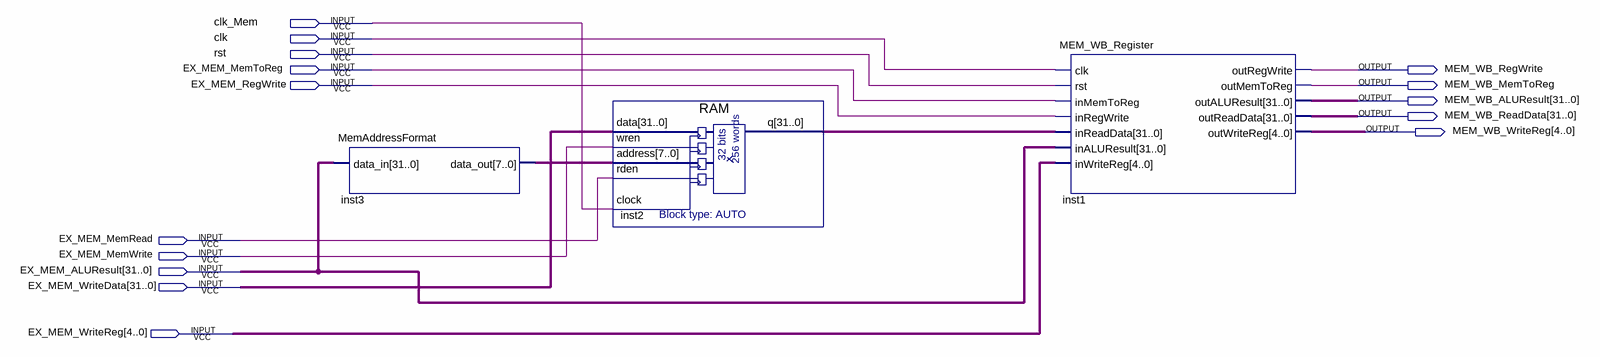
[diagram p0: schematic sheet]
// Quartus schematic MEM_STAGE.bdf as structural Verilog: 3 symbols, 15 pins
module MEM_STAGE (
  input  clk_Mem,
  input  clk,
  input  rst,
  input  EX_MEM_MemToReg,
  input  EX_MEM_RegWrite,
  input  EX_MEM_MemRead,
  input  EX_MEM_MemWrite,
  input  [31:0] EX_MEM_ALUResult,
  input  [31:0] EX_MEM_WriteData,
  input  [4:0] EX_MEM_WriteReg,
  output MEM_WB_RegWrite,
  output MEM_WB_MemToReg,
  output [31:0] MEM_WB_ALUResult,
  output [31:0] MEM_WB_ReadData,
  output [4:0] MEM_WB_WriteReg
);

  wire [7:0] inst3_data_out;
  wire [31:0] inst2_q;

  MemAddressFormat inst3 (.data_in(EX_MEM_ALUResult), .data_out(inst3_data_out));
  RAM inst2 (
    .data(EX_MEM_WriteData), .wren(EX_MEM_MemWrite), .address(inst3_data_out), .rden(EX_MEM_MemRead),
    .clock(clk_Mem), .q(inst2_q));
  MEM_WB_Register inst1 (
    .clk(clk), .rst(rst), .inMemToReg(EX_MEM_MemToReg), .inRegWrite(EX_MEM_RegWrite), .inReadData(inst2_q),
    .inALUResult(EX_MEM_ALUResult), .inWriteReg(EX_MEM_WriteReg), .outRegWrite(MEM_WB_RegWrite),
    .outMemToReg(MEM_WB_MemToReg), .outALUResult(MEM_WB_ALUResult), .outReadData(MEM_WB_ReadData),
    .outWriteReg(MEM_WB_WriteReg));
endmodule
